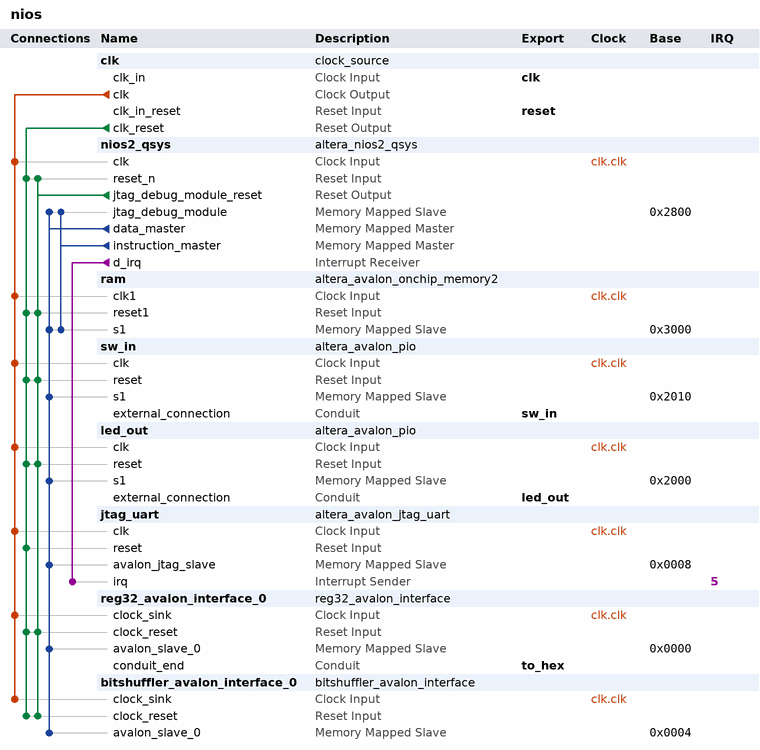
[diagram p0: system contents]
# Platform Designer (Qsys) system nios, Cyclone V 5CSEMA5F31C6
# Parameters at their usual value, and those the tool derives, are not listed.
package require -exact qsys 17.1
create_system nios
set_project_property DEVICE_FAMILY {Cyclone V}
set_project_property DEVICE 5CSEMA5F31C6

add_instance clk clock_source 17.1
set_instance_parameter_value clk clockFrequency 50000000

add_instance nios2_qsys altera_nios2_qsys 16.1
set_instance_parameter_value nios2_qsys breakSlave nios2_qsys.jtag_debug_module
set_instance_parameter_value nios2_qsys exceptionSlave ram.s1
set_instance_parameter_value nios2_qsys icache_size 4096
set_instance_parameter_value nios2_qsys impl Small
set_instance_parameter_value nios2_qsys mmu_TLBMissExcSlave None
set_instance_parameter_value nios2_qsys resetSlave ram.s1
set_instance_parameter_value nios2_qsys resetrequest_enabled false

add_instance ram altera_avalon_onchip_memory2 17.1
set_instance_parameter_value ram dataWidth 32
set_instance_parameter_value ram dualPort false
set_instance_parameter_value ram initMemContent true
set_instance_parameter_value ram initializationFileName onchip_mem.hex
set_instance_parameter_value ram memorySize 4096

add_instance sw_in altera_avalon_pio 17.1
set_instance_parameter_value sw_in direction Input
set_instance_parameter_value sw_in width 10

add_instance led_out altera_avalon_pio 17.1
set_instance_parameter_value led_out direction Output
set_instance_parameter_value led_out width 10

add_instance jtag_uart altera_avalon_jtag_uart 17.1
set_instance_parameter_value jtag_uart simInteractiveOptions NO_INTERACTIVE_WINDOWS

add_instance reg32_avalon_interface_0 reg32_avalon_interface 1.0

add_instance bitshuffler_avalon_interface_0 bitshuffler_avalon_interface 1.0

# connections
add_connection clk.clk bitshuffler_avalon_interface_0.clock_sink clock
add_connection clk.clk jtag_uart.clk clock
add_connection clk.clk led_out.clk clock
add_connection clk.clk nios2_qsys.clk clock
add_connection clk.clk ram.clk1 clock
add_connection clk.clk reg32_avalon_interface_0.clock_sink clock
add_connection clk.clk sw_in.clk clock
add_connection clk.clk_reset bitshuffler_avalon_interface_0.clock_reset reset
add_connection clk.clk_reset jtag_uart.reset reset
add_connection clk.clk_reset led_out.reset reset
add_connection clk.clk_reset nios2_qsys.reset_n reset
add_connection clk.clk_reset ram.reset1 reset
add_connection clk.clk_reset reg32_avalon_interface_0.clock_reset reset
add_connection clk.clk_reset sw_in.reset reset
add_connection nios2_qsys.jtag_debug_module_reset bitshuffler_avalon_interface_0.clock_reset reset
add_connection nios2_qsys.jtag_debug_module_reset led_out.reset reset
add_connection nios2_qsys.jtag_debug_module_reset nios2_qsys.reset_n reset
add_connection nios2_qsys.jtag_debug_module_reset ram.reset1 reset
add_connection nios2_qsys.jtag_debug_module_reset reg32_avalon_interface_0.clock_reset reset
add_connection nios2_qsys.jtag_debug_module_reset sw_in.reset reset
add_connection nios2_qsys.data_master bitshuffler_avalon_interface_0.avalon_slave_0 avalon
set_connection_parameter_value nios2_qsys.data_master/bitshuffler_avalon_interface_0.avalon_slave_0 baseAddress 0x0004
add_connection nios2_qsys.data_master jtag_uart.avalon_jtag_slave avalon
set_connection_parameter_value nios2_qsys.data_master/jtag_uart.avalon_jtag_slave baseAddress 0x0008
add_connection nios2_qsys.data_master led_out.s1 avalon
set_connection_parameter_value nios2_qsys.data_master/led_out.s1 baseAddress 0x2000
add_connection nios2_qsys.data_master nios2_qsys.jtag_debug_module avalon
set_connection_parameter_value nios2_qsys.data_master/nios2_qsys.jtag_debug_module baseAddress 0x2800
add_connection nios2_qsys.data_master ram.s1 avalon
set_connection_parameter_value nios2_qsys.data_master/ram.s1 baseAddress 0x3000
add_connection nios2_qsys.data_master reg32_avalon_interface_0.avalon_slave_0 avalon
set_connection_parameter_value nios2_qsys.data_master/reg32_avalon_interface_0.avalon_slave_0 baseAddress 0x0000
add_connection nios2_qsys.data_master sw_in.s1 avalon
set_connection_parameter_value nios2_qsys.data_master/sw_in.s1 baseAddress 0x2010
add_connection nios2_qsys.instruction_master nios2_qsys.jtag_debug_module avalon
set_connection_parameter_value nios2_qsys.instruction_master/nios2_qsys.jtag_debug_module baseAddress 0x2800
add_connection nios2_qsys.instruction_master ram.s1 avalon
set_connection_parameter_value nios2_qsys.instruction_master/ram.s1 baseAddress 0x3000
add_connection nios2_qsys.d_irq jtag_uart.irq interrupt
set_connection_parameter_value nios2_qsys.d_irq/jtag_uart.irq irqNumber 5

# exported interfaces
add_interface clk clock sink
set_interface_property clk EXPORT_OF clk.clk_in
add_interface led_out conduit end
set_interface_property led_out EXPORT_OF led_out.external_connection
add_interface reset reset sink
set_interface_property reset EXPORT_OF clk.clk_in_reset
add_interface sw_in conduit end
set_interface_property sw_in EXPORT_OF sw_in.external_connection
add_interface to_hex conduit end
set_interface_property to_hex EXPORT_OF reg32_avalon_interface_0.conduit_end

set_interconnect_requirement {$system} qsys_mm.clockCrossingAdapter HANDSHAKE
set_interconnect_requirement {$system} qsys_mm.enableEccProtection FALSE
set_interconnect_requirement {$system} qsys_mm.insertDefaultSlave FALSE
set_interconnect_requirement {$system} qsys_mm.maxAdditionalLatency 1

save_system nios.qsys
